# Altium schematic sheet SheetMCU.SchDoc
size A3
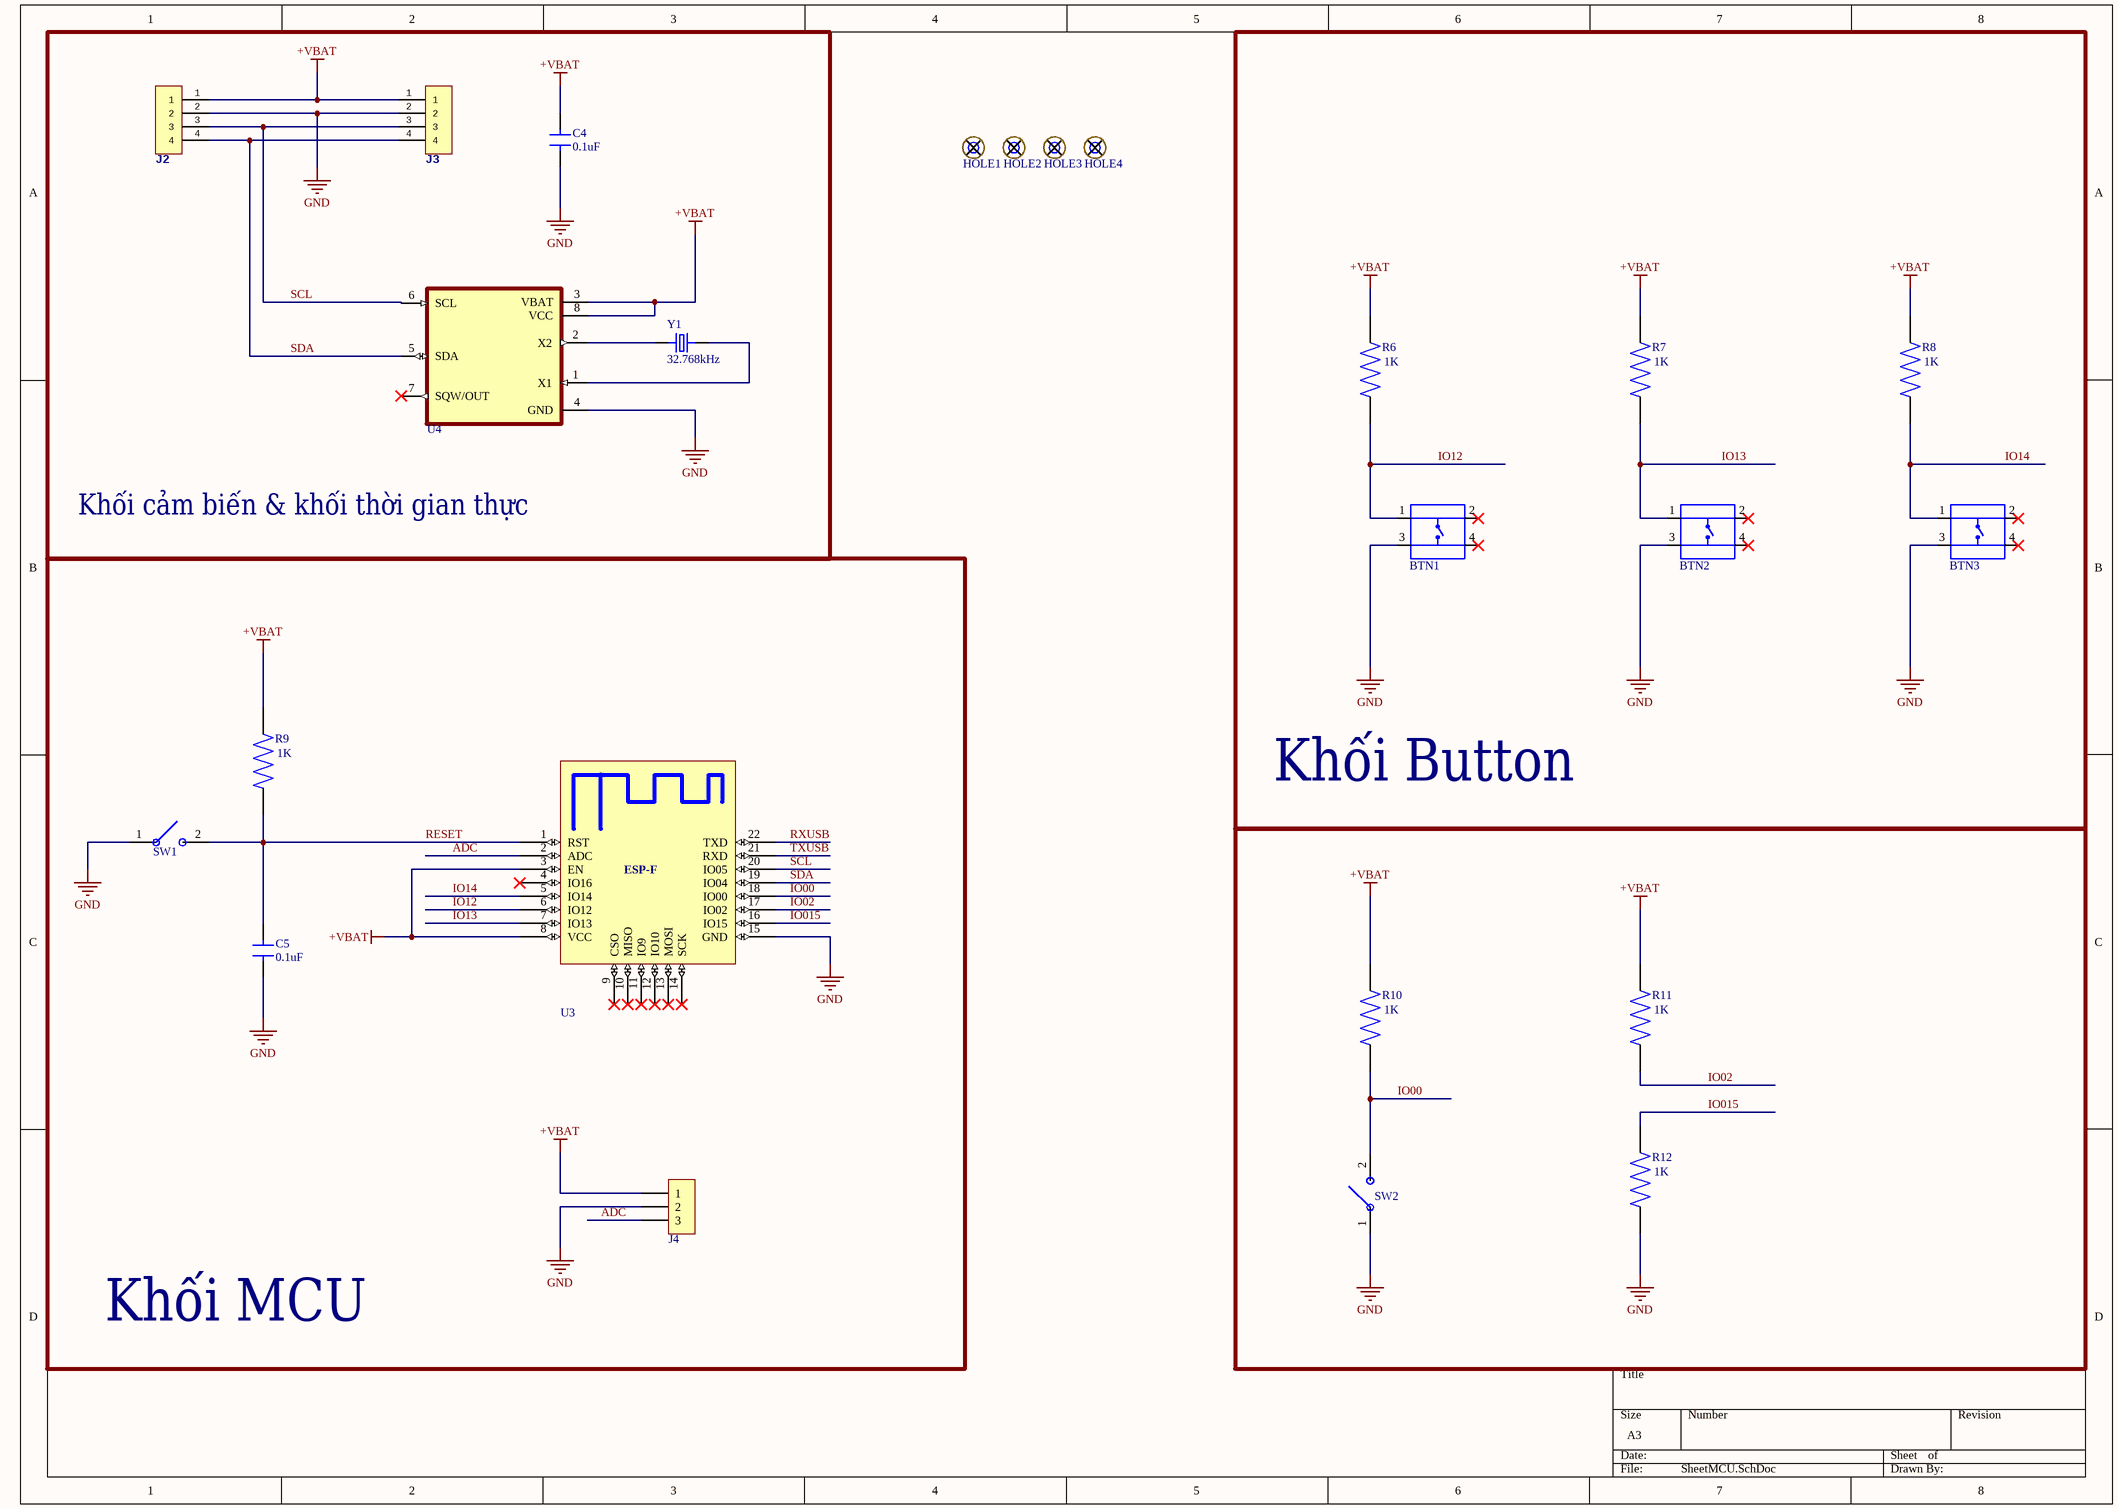
[diagram p0: SheetMCU.SchDoc]

## Parts
BTN1  button 4x4  [SW_2-1825910-7]  (value not drawn)
BTN2  button 4x4  [SW_2-1825910-7]  (value not drawn)
BTN3  button 4x4  [SW_2-1825910-7]  (value not drawn)
C4  0.1uF  [CAP104 0.1UF 50V]
C5  0.1uF  [CAP104 0.1UF 50V]
HOLE1  Hole  [Hole 2MM]  (value not drawn)
HOLE2  Hole  [Hole 2MM]  (value not drawn)
HOLE3  Hole  [Hole 2MM]  (value not drawn)
HOLE4  Hole  [Hole 2MM]  (value not drawn)
J2  SAMTEC-HTSW-104-07-X-SJ  [Conn 4 Pos]  (value not drawn)
J3  SAMTEC-HTSW-104-07-X-SJ  [Conn 4 Pos]  (value not drawn)
J4  CONN HEADER VERT 3POS 2.54MM  [CONN HEADER VERT 3POS 2.54MM]  (value not drawn)
R6  1K  [RC0805 1K OHM]
R7  1K  [RC0805 1K OHM]
R8  1K  [RC0805 1K OHM]
R9  1K  [RC0805 1K OHM]
R10  1K  [RC0805 1K OHM]
R11  1K  [RC0805 1K OHM]
R12  1K  [RC0805 1K OHM]
SW1  Switch  [PTS636 SM43J SMTR LFS]  (value not drawn)
SW2  Switch  [PTS636 SM43J SMTR LFS]  (value not drawn)
U3  ESP8266 ESP_F  [ESP8266 ESP-F]  (value not drawn)
U4  DS1307Z+  [SOIC127P600X175-8N]  (value not drawn)
Y1  32.768kHz  [XTAL_ECS-3X8X]

## Blocks framed on the sheet
Khối cảm biến & khối thời gian thực: C4 J2 J3 U4 Y1
Khối Button: BTN1-BTN3 R6-R8
Khối MCU: C5 J4 R9 SW1 U3

## Nets
+VBAT: C4.2 J2.1 J3.1 J4.1 R6.2 R7.2 R8.2 R9.2 R10.2 R11.2 U3.3(EN) U3.8(VCC) U4.3(VBAT) U4.8(VCC)
GND: BTN1.3 BTN2.3 BTN3.3 C4.1 C5.1 J2.2 J3.2 J4.2 R12.1 SW1.1 SW2.1 U3.15(GND) U4.4(GND)
ADC: J4.3 U3.2(ADC)
IO00: R10.1 SW2.2 U3.18(IO00)
IO02: R11.1 U3.17(IO02)
IO12: BTN1.1 R6.1 U3.6(IO12)
IO13: BTN2.1 R7.1 U3.7(IO13)
IO14: BTN3.1 R8.1 U3.5(IO14)
IO015: R12.2 U3.16(IO15)
RESET: C5.2 R9.1 SW1.2 U3.1(RST)
RXUSB: U3.22(TXD)
SCL: J2.3 J3.3 U3.20(IO05) U4.6(SCL)
SDA: J2.4 J3.4 U3.19(IO04) U4.5(SDA)
TXUSB: U3.21(RXD)
NetU4_1: U4.1(X1) Y1.2
NetU4_2: U4.2(X2) Y1.1

Not connected (* = marked no-connect by the designer): BTN1 2* 4*; BTN2 2* 4*; BTN3 2* 4*; U3 4(IO16)* 9(CSO)* 10(MISO)* 11(IO9)* 12(IO10)* 13(MOSI)* 14(SCK)*; U4 7(SQW/OUT)*

## Notes on the sheet
- (in symbol 2491) ESP-F

## Library data of the parts
BTN1-BTN3 = TL1105BF160Q: Switch Tactile N.O. SPST Round Button PC Pins 0.05A 50VDC 1.57N Thru-Hole; Manufacturer: E-Switch; Mechanical Life: 100000Cycles; Actuator Material: Nylon,Polyamide; Current Rating: 50mA; Operating Force: 160gf; Voltage Rating (DC): 12V; Max Voltage Rating (DC): 50V; Contact Resistance: 100mR; Illumination Type: Non-Illuminated,Illuminated; Switch Travel: 0.25mm; Switch Function: Off-Mom; Actuator Type: Standard; Actuator Length: 5.9mm; Supplier 1: Digi-Key; Manufacturer Part Number: TL1105BF160Q; Stock 1: 13775; Pricing 1: 1 = 0.20000, 10 = 0.19300, 25 = 0.18320, 100 = 0.16660, 250 = 0.15664, 500 = 0.14332, 1000 = 0.11999, 2500 = 0.11666, 5000 = 0.10999 (USD); RoHS: Yes; Mount: Through Hole; Contact Plating: Silver; Contact Material: Silver,Bronze; Housing Material: Nylon; Min Operating Temperature: -20°C; Max Operating Temperature: 70°C; Package Quantity: 750; Packaging: Bulk; Throw Configuration: SPST; Termination: PC Pin; Electrical Life: 100000Cycles; Orientation: Straight; Contact Current Rating: 50mA; Voltage Rating: 12V; Insulation Resistance: 100MR; Series: TL1105; Width: 6mm; REACH SVHC: No SVHC; Lead Free: Lead Free; RoHS Compliant: Yes; ComponentLink1URL: https://datasheet.ciiva.com/16156/p010003-16156249.pdf?src-supplier=Onlinecomponents.com; ComponentLink1Description: https://datasheet.ciiva.com/16156/p010003-16156249.pdf?src-supplier=Onlinecomponents.com; ComponentLink2URL: https://datasheet.ciiva.com/7637/tl1105-7637643.pdf?src-supplier=Element14; ComponentLink2Description: https://datasheet.ciiva.com/7637/tl1105-7637643.pdf?src-supplier=Element14; ComponentLink3URL: https://datasheet.ciiva.com/2900/p010003-2900804.pdf?src-supplier=Digi-Key; ComponentLink3Description: https://datasheet.ciiva.com/2900/p010003-2900804.pdf?src-supplier=Digi-Key; Supplier Part Number 1: EG1833-ND
C4 C5 = C0805C104K5RACTU: Cap Ceramic 0.1uF 50V X7R 10% SMD 2.0 x 1.2 mm 125 C Paper T/R; Manufacturer: KEMET; Capacitance: 100nF; Voltage: 500V; Supplier 1: Digi-Key; Manufacturer Part Number: C0805C104K5RACTU; Stock 1: 2487008; Pricing 1: 1 = 0.16000, 10 = 0.11500, 50 = 0.06540, 100 = 0.05420, 500 = 0.03802, 1000 = 0.03147 (USD); RoHS: Yes; Mount: Surface Mount,PCB; Case/Package: 0805; Number of Pins: 2; Dielectric Material: Ceramic; Case Code (Imperial): 0805; Case Code (Metric): 2012; Contact Plating: Tin,Matte; Min Operating Temperature: -55°C; Max Operating Temperature: 125°C; Tolerance: 10%; Packaging: Tape and Reel; Voltage Rating (DC): 50V; Dielectric: X7R; Termination: SMD/SMT; Package Quantity: 4000; Voltage Rating: 50V; Length: 2mm; Height: 0.9mm; Width: 1.2mm; Lead Pitch: 0.75mm; Depth: 1.25mm; Thickness: 0.035inch; Radiation Hardening: No; REACH SVHC: No SVHC; ComponentLink1URL: https://datasheet.ciiva.com/14589/70095383-14589048.pdf?src-supplier=Allied+Electronics; ComponentLink1Description: https://datasheet.ciiva.com/14589/70095383-14589048.pdf?src-supplier=Allied+Electronics; ComponentLink2URL: https://datasheet.ciiva.com/28682/1851736-28682232.pdf?src-supplier=Element14; ComponentLink2Description: https://datasheet.ciiva.com/28682/1851736-28682232.pdf?src-supplier=Element14; ComponentLink3URL: https://datasheet.ciiva.com/32431/slceramic-chip-condensers-e-32431755.pdf?src-supplier=Distrelec; ComponentLink3Description: https://datasheet.ciiva.com/32431/slceramic-chip-condensers-e-32431755.pdf?src-supplier=Distrelec; ComponentLink4URL: https://datasheet.ciiva.com/18410/70095383-18410815.pdf?src-supplier=Allied+Electronics; ComponentLink4Description: https://datasheet.ciiva.com/18410/70095383-18410815.pdf?src-supplier=Allied+Electronics; Supplier Part Number 1: 399-1170-1-ND
HOLE1-HOLE4 = Hole 2mm: Hole 3mm
J2 J3 = SAMTEC-HTSW-104-07-X-SJ: CONN HEADER 4 POS 2.54mm
J4 = 87220-3: Conn Unshrouded Header HDR 3 POS 2.54mm Solder ST Thru-Hole; Manufacturer: TE Connectivity; Gender: Male; Board Standoff: No (Without); High Speed Serial Data Connector: No; PCB Mount Retention: Without; PCB Mounting Orientation: Vertical; Connector Type: Plug,Header,Pin; Number of Positions: 3; Current Rating: 3A; PCB Thickness: 1.397mm; Contact Post Length: 0.125inch; Approvals: CSA; Supplier 1: Digi-Key; Manufacturer Part Number: 87220-3; Stock 1: 7787; Pricing 1: 1 = 2.57000, 10 = 2.33000, 100 = 1.99710, 500 = 1.66428, 1000 = 1.42653, 5000 = 1.26486, 10000 = 1.23633 (USD); RoHS: Yes; Mount: Through Hole; Housing Color: Black; Contact Shape: Square; Housing Material: Thermoplastic; Contact Plating: Gold; Contact Material: Bronze; Color: Black; Min Operating Temperature: -65°C; Max Operating Temperature: 105°C; Orientation: Straight; Contact Protection: No (Without); Gasket: No (Without); High Temperature Housing: No; Keyed: No; Mating Alignment: No (Without); Mating Connector Lock: No (Without); Selectively Loaded: No (Without); Stabilizers: No (Without); Strain Relief: No (Without); Packaging: Carton; Number of Rows: 1; Package Quantity: 500; Contact Gender: Male; Termination: Through Hole; Contact Current Rating: 3A; Number of Contacts: 3; Length: 7.21mm; Pitch: 2.54mm; Contact Mating Length: 8.08mm; Row Spacing: 2.54mm; Depth: 2.54mm; Radiation Hardening: No; Lead Free: Lead Free; ELV: Compliant; Flammability Rating: UL94 V-0; ComponentLink1URL: https://datasheet.ciiva.com/27055/1934500-27055078.pdf?src-supplier=Jameco; ComponentLink1Description: https://datasheet.ciiva.com/27055/1934500-27055078.pdf?src-supplier=Jameco; ComponentLink2URL: https://datasheet.ciiva.com/11754/0900766b80fa3621-11754119.pdf?src-supplier=RSComponents; ComponentLink2Description: https://datasheet.ciiva.com/11754/0900766b80fa3621-11754119.pdf?src-supplier=RSComponents; ComponentLink3URL: https://datasheet.ciiva.com/709/eng-cd-87220-k3-709958.pdf?src-supplier=Digi-Key; ComponentLink3Description: https://datasheet.ciiva.com/709/eng-cd-87220-k3-709958.pdf?src-supplier=Digi-Key; ComponentLink4URL: https://datasheet.ciiva.com/14640/70082841-14640726.pdf?src-supplier=Allied+Electronics; ComponentLink4Description: https://datasheet.ciiva.com/14640/70082841-14640726.pdf?src-supplier=Allied+Electronics; ComponentLink5URL: https://datasheet.ciiva.com/16391/eng-cs-1307819-section-5-0908-16391079.pdf?src-supplier=Future+Electronics; ComponentLink5Description: https://datasheet.ciiva.com/16391/eng-cs-1307819-section-5-0908-16391079.pdf?src-supplier=Future+Electronics; Supplier Part Number 1: A26544-ND
R6-R12 = RC0805FR-071KL: 贴片电阻 1000Ω ± 1.00% 0.125W ± 100ppm/℃ 0805; Manufacturer: Yageo; Resistance: 1kR; Tolerance: 1%; Temperature Coefficient: 100ppm/°C; Power Rating: 125mW; Voltage Rating (DC): 150V; Supplier 1: Digi-Key; Manufacturer Part Number: RC0805FR-071KL; Stock 1: 4142320; Pricing 1: 5000 = 0.00544 (USD); RoHS: Yes; Case/Package: 0805; Number of Pins: 2; Case Code (Metric): 2012; Case Code (Imperial): 0805; Size Code: 0805; Min Operating Temperature: -55°C; Max Operating Temperature: 155°C; Packaging: Tape and Reel; Resistor Type: Thick Film; Package Quantity: 1; Voltage Rating: 150V; Number of Terminations: 2; Termination: SMD/SMT; Max Power Dissipation: 125mW; Features: Moisture Resistant; Series: RC; Resistance Tolerance: 1%; Construction: Rectangular; Length: 0.079inch; Width: 0.049inch; Height: 0.024inch; Depth: 1.25mm; REACH SVHC: Unknown; Lead Free: Lead Free; Military Standard: Not; RoHS Compliant: Yes; Supplier Part Number 1: 311-1.00KCRTR-ND
SW1 SW2 = PTS636SM43JSMTRLFS: Switch Reset; Manufacturer: ITT C&K; Supplier 1: Digi-Key; Manufacturer Part Number: PTS636SM43JSMTRLFS; Stock 1: 0; RoHS: No; Supplier Part Number 1: CKN12317-1-ND
U3 = 2491: ESP8266 SMT MODULE; Manufacturer: Adafruit Industries; Frequency: 2.4GHz; Interface: I2C,SPI,UART; Data Rate: 72.2Mbps; Sensitivity: -91dBm; Current - Transmitting: 170mA; Current - Receiving: 56mA; Supplier 1: Digi-Key; Manufacturer Part Number: 2491; Stock 1: 1712; Pricing 1: 1 = 6.95000 (USD); RoHS: Yes; Mount: Surface Mount; Case/Package: Module; Min Operating Temperature: -40°C; Max Operating Temperature: 125°C; Packaging: Bulk; ComponentLink1URL: https://www.mouser.com/ds/2/737/0A-ESP8266__Datasheet__EN_v4.3-1095239.pdf?src-supplier=Mouser; ComponentLink1Description: https://www.mouser.com/ds/2/737/0A-ESP8266__Datasheet__EN_v4.3-1095239.pdf?src-supplier=Mouser; ComponentLink2URL: https://www.adafruit.com/images/product-files/2471/0A-ESP8266__Datasheet__EN_v4.3.pdf?src-supplier=Digi-Key; ComponentLink2Description: https://www.adafruit.com/images/product-files/2471/0A-ESP8266__Datasheet__EN_v4.3.pdf?src-supplier=Digi-Key; Supplier Part Number 1: 1528-1438-ND
U4 = DS1307Z+: Real Time Clock _RTC_ IC Clock/Calendar 56B IÂ²C, 2-Wire Serial 8-SOIC _0.154, 3.90mm Width_; MF: Maxim Integrated; Availability: Unavailable; SnapEDA_Link: https://www.snapeda.com/parts/DS1307Z/Maxim%20Integrated/view-part/524266/?ref=snap; Price: None; Package: SO-8 Maxim Integrated; MP: DS1307Z; Value: *
Y1 = ECS-3X8X: 32.768kHz Â±20ppm Crystal 12.5pF 35 kOhms Cylindrical Can, Radial; MF: ECS Inc.; Value: *; Package: Cylindrical Can Radial  ECS International; SnapEDA_Link: https://www.snapeda.com/parts/ECS-3X8X/ECS%20Inc./view-part/2454480/?ref=snap; MP: ECS-3X8X